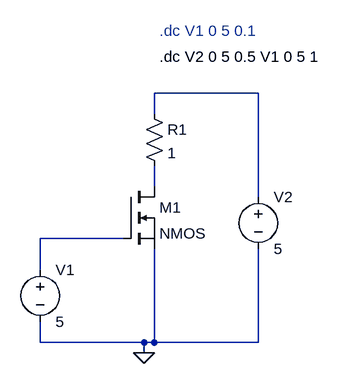
[diagram p0: schematic CL1_T6_AnalysisOfAn_nMOS_Transistor.asc]
CL1_T6_AnalysisOfAn_nMOS_Transistor.asc, the LTspice schematic file:
Version 4.1
SHEET 1 880 680
WIRE 400 -32 240 -32
WIRE 240 0 240 -32
WIRE 240 112 240 80
WIRE 400 128 400 -32
WIRE 192 192 64 192
WIRE 64 240 64 192
WIRE 64 352 64 320
WIRE 224 352 64 352
WIRE 240 352 240 208
WIRE 240 352 224 352
WIRE 400 352 400 208
WIRE 400 352 240 352
WIRE 224 368 224 352
FLAG 224 368 0
SYMBOL nmos 192 112 R0
SYMATTR InstName M1
SYMBOL res 224 -16 R0
SYMATTR InstName R1
SYMATTR Value 1
SYMBOL voltage 64 224 R0
WINDOW 123 0 0 Left 0
WINDOW 39 0 0 Left 0
SYMATTR InstName V1
SYMATTR Value 5
SYMBOL voltage 400 112 R0
WINDOW 123 0 0 Left 0
WINDOW 39 0 0 Left 0
SYMATTR InstName V2
SYMATTR Value 5
TEXT 248 -128 Left 2 ;.dc V1 0 5 0.1
TEXT 248 -88 Left 2 !.dc V2 0 5 0.5 V1 0 5 1

The netlist it stands for:
* CL1_T6_AnalysisOfAn_nMOS_Transistor.asc
M1 N002 N003 0 0 NMOS
R1 N001 N002 1
V1 N003 0 5
V2 N001 0 5
.model NMOS NMOS
.model PMOS PMOS
.lib standard.mos
* .dc V1 0 5 0.1
.dc V2 0 5 0.5 V1 0 5 1
.backanno
.end